# EAGLE design 38kHzSensorRevB1 (EAGLE 7.5.0)
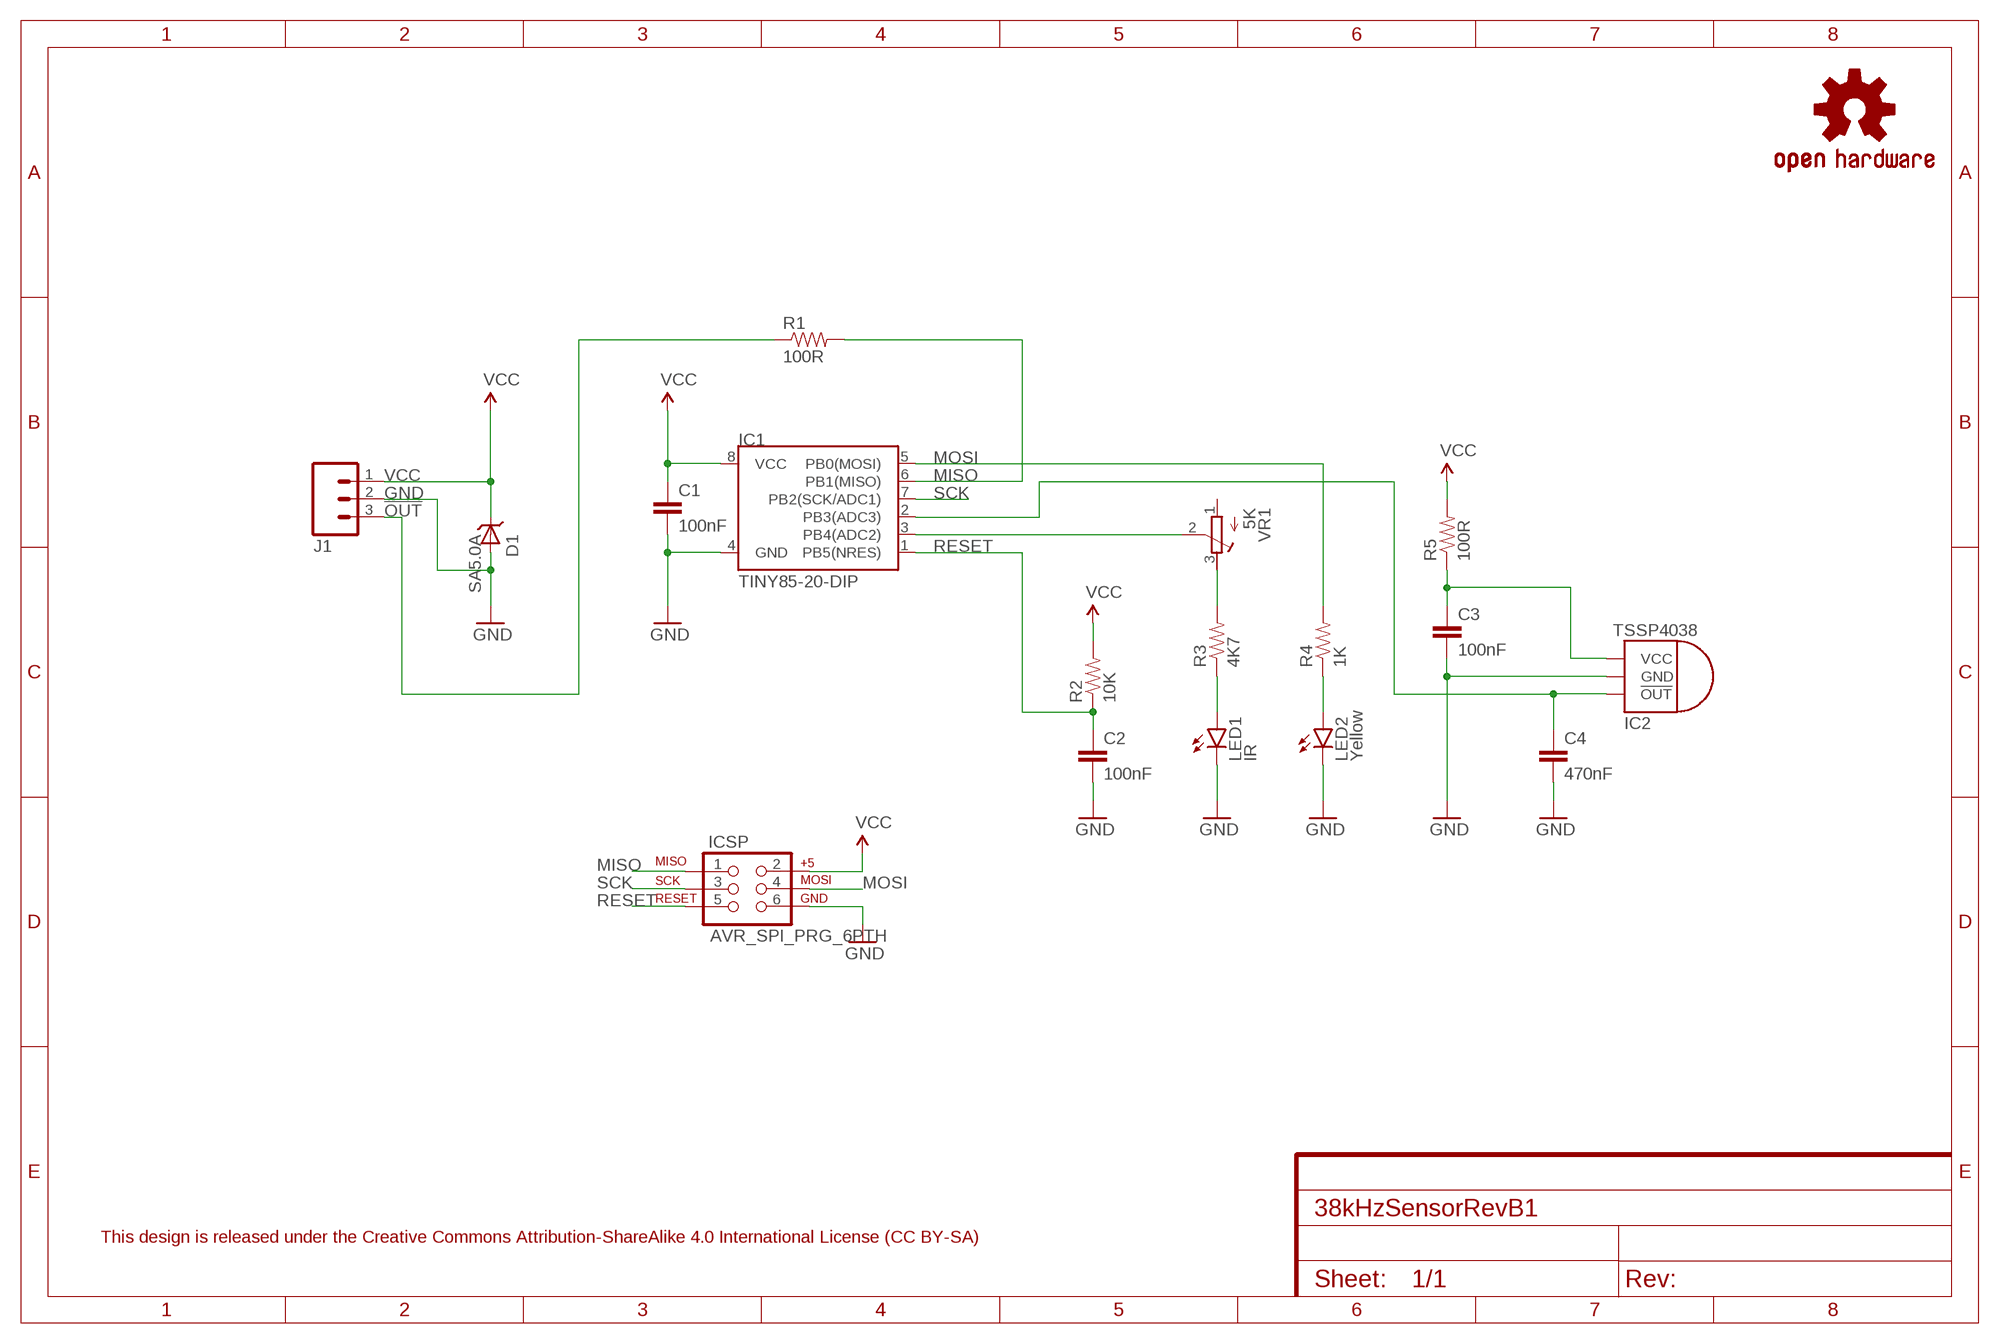
[diagram p0: schematic, sheet 1]
FRAME1 (FRAME-A4L): CNAME: 38kHz IR Simulator Sensor (Variant 1); CREVISION: B/1; DESIGNER: Andrew Instone-Cowie

## Parts
C1  100nF  CAPPTH  [CAP-PTH-SMALL]
C2  100nF  CAPPTH  [CAP-PTH-SMALL]
C3  100nF  CAPPTH  [CAP-PTH-SMALL]
C4  470nF  CAPPTH1  [CAP-PTH-5MM]
D1  SA5.0A  [DO41_TVS_UNI]
IC1  TINY85-20-DIP  ATTINY45TINY85-20-DIP  [DIP08]
IC2  TSSP4038EDGE  [TSSP4038_PKG_EDGE]
ICSP  AVR_SPI_PRG_6PTH  [2X3]
J1  M03PTH  [1X03]
LED1  IR  LED5MM  [LED5MM]
LED2  Yellow  LED3MM  [LED3MM]
LOGO1  OSHW-LOGOS  [OSHW-LOGO-S]
R1  100R  RESISTORPTH-1/4W  [AXIAL-0.4]
R2  10K  RESISTORPTH-1/4W  [AXIAL-0.4]
R3  4K7  RESISTORPTH-1/4W  [AXIAL-0.4]
R4  1K  RESISTORPTH-1/4W  [AXIAL-0.4]
R5  100R  RESISTORPTH-1/4W  [AXIAL-0.4]
VR1  5K  R-TRIMM3296X  [RTRIM3296X]

## Nets
!OUT: J1.3 R1.P$1
GND: C1.2 C2.2 C3.2 C4.2 D1.ANODE IC1.4(GND) IC2.GND ICSP.6 J1.2 LED1.K(C) LED2.K(C)
MISO: IC1.6(PB1(MISO)) ICSP.1 R1.P$2
MOSI: IC1.5(PB0(MOSI)) ICSP.4 R4.P$2
N$1: IC1.3(PB4(ADC2)) VR1.2(S)
N$2: R3.P$2 VR1.3(E)
N$3: C4.1 IC1.2(PB3(ADC3)) IC2.OUT(!OUT)
N$4: C3.1 IC2.VCC R5.P$1
N$5: LED1.A R3.P$1
N$6: LED2.A R4.P$1
RESET: C2.1 IC1.1(PB5(NRES)) ICSP.5 R2.P$1
SCK: IC1.7(PB2(SCK/ADC1)) ICSP.3
VCC: C1.1 D1.CATHODE IC1.8(VCC) ICSP.2 J1.1 R2.P$2 R5.P$2
Unconnected: VR1.1(A)

## Notes on the sheet
- This design is released under the Creative Commons Attribution-ShareAlike 4.0 International License (CC BY-SA)

## Library data of the parts
C1-C4 = SparkFun-Passives:CAP: Capacitor Standard 0603 ceramic capacitor, and 0.1" leaded capacitor.
D1 = AIC_Custom:SA5.0A: SA5.0CA TVS Uni-Directional Transient Voltage Suppressor. 5V, DO41 package
IC1 = SparkFun-DigitalIC:ATTINY45: Atmel 8-pin 2/4/8kB flash uC; PROD_ID: IC-09445
IC2 = AIC_Custom:TSSP4038: TSSP4038 38kHz IR Receiver
ICSP = SparkFun-Connectors:AVR_SPI_PRG_6: AVR ISP 6 Pin This is the reduced ISP connector for AVR programming. Common on Arduino. This footprint will take up less PCB space and can be used with a 10-pin to 6-pin adapter such as SKU: BOB-08508 **Special note about "TEST_POINT" package. The stop mask is on the top side, so if you want your programming test points to be on the bottom of your board, make sure to place this package on the bottom side of the board. This also ensure that the orientation to program from the bottom side will be correct.
J1 = SparkFun-Connectors:M03: Header 3 Standard 3-pin 0.1" header. Use with straight break away headers (SKU : PRT-00116), right angle break away headers (PRT-00553), swiss pins (PRT-00743), machine pins (PRT-00117), and female headers (PRT-00115). Molex polarized connector foot print use with SKU : PRT-08232 with associated crimp pins and housings.
LED1 LED2 = SparkFun-LED:LED: LEDs Standard schematic elements and footprints for 5mm, 3mm, 1206, and 0603 sized LEDs. 5mm - Spark Fun Electronics SKU : COM-00529 (and others)
LOGO1 = SparkFun-Aesthetics:OSHW-LOGO: Open Source Hardware Logo This logo indicates the piece of hardware it is found on incorporates a OSHW license and/or adheres to the definition of open source hardware found here: http://freedomdefined.org/OSHW
R1-R5 = SparkFun-Passives:RESISTOR: Resistor Basic schematic elements and footprints for 0603, 1206, and PTH resistors.
VR1 = resistor:R-TRIMM: Trimm resistor

## Board
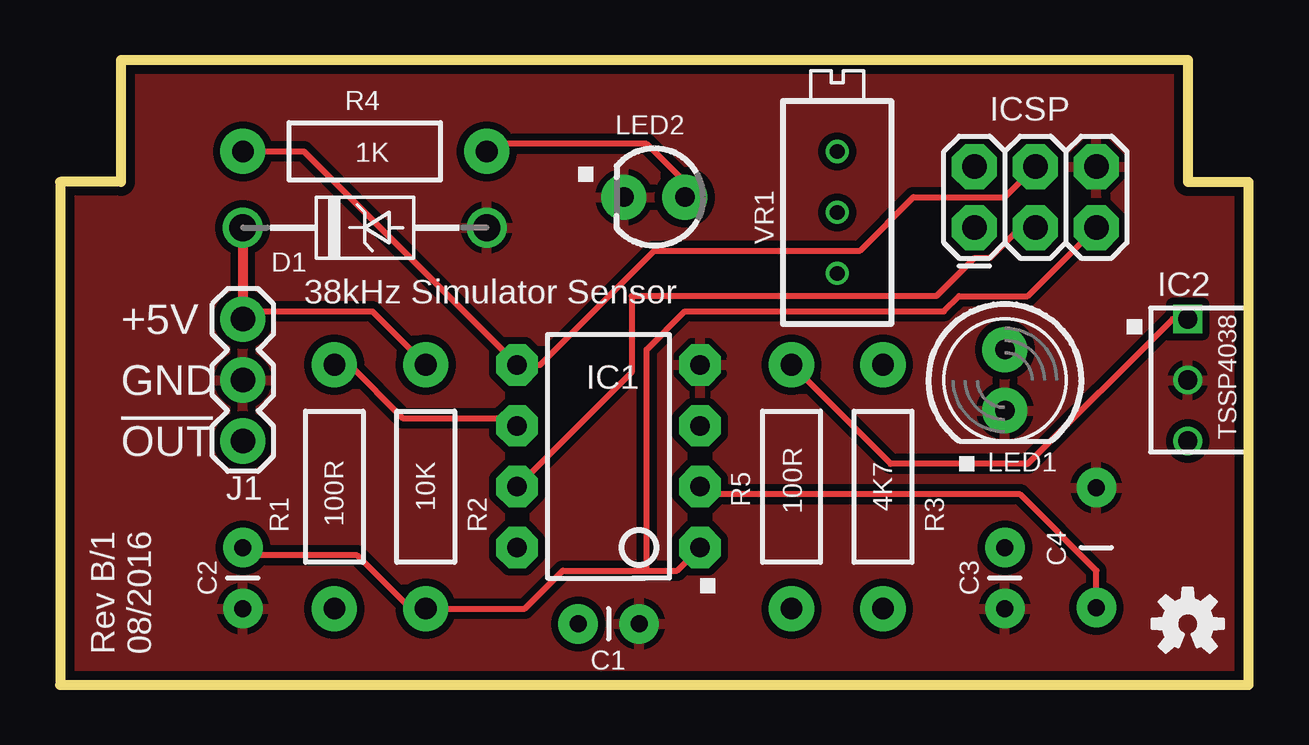
[diagram p1: board, top side]
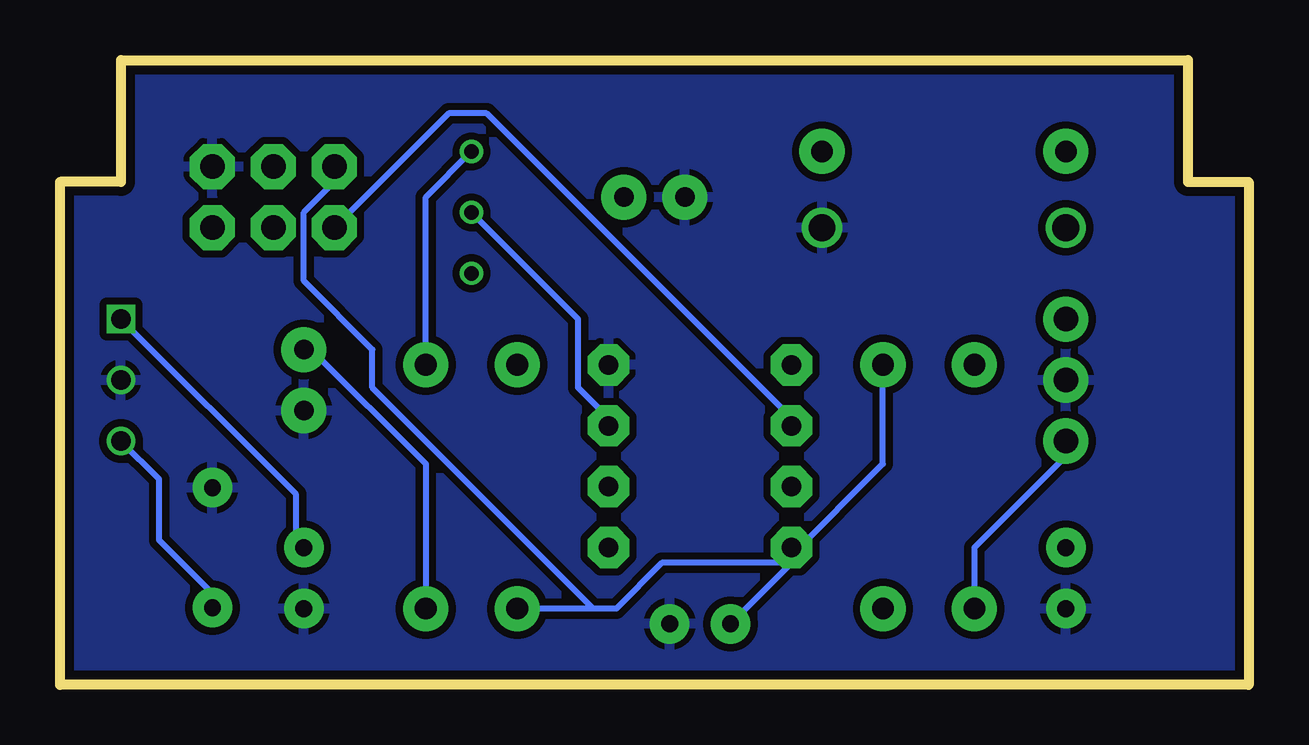
[diagram p2: board, bottom side, seen from below]

Size 49.53 x 26.04 mm. Coordinates in mm from the lower left corner, seen from the top.
Outline: 0,0 49.53,0 49.53,20.95 46.99,20.95 46.99,26.04 2.54,26.04 2.54,20.95 0,20.95 0,0
Copper layers (1*16): Top 0.0356mm / dielectric 1.5011mm / Bottom 0.0356mm
Design rules "LaenPCBOrder(OSHPARK)": minimum track width 6mil, minimum drill 13mil, track to track 6mil, track to pad 6mil, pad to pad 6mil, via to via 6mil, smd to smd 6mil, copper to edge 15mil, drill to drill 6mil, minimum pad ring 7mil, minimum via ring 7mil, stop-mask expansion 3mil, vias tented up to drill 0mil, thermal gap 10mil

### Footprints (pad centres in the part's own frame; a part is rotated, then mirrored left to right if it is on the bottom)
CAP-PTH-SMALL = drill 0.7 pad 1.651: 1 0,0; 2 2.54,0
CAP-PTH-5MM = drill 0.7 pad 1.651: 1 -2.5,0; 2 2.5,0
DO41_TVS_UNI = drill 1.118: ANODE -5.08,0; CATHODE 5.08,0
DIP08 = drill 0.813 pad 1.727 octagon: 1 -3.81,-3.81; 2 -1.27,-3.81; 3 1.27,-3.81; 4 3.81,-3.81; 5 3.81,3.81; 6 1.27,3.81; 7 -1.27,3.81; 8 -3.81,3.81
TSSP4038_PKG_EDGE = drill 0.8: GND 0,0; OUT 2.54,0 | drill 0.8 square: VCC -2.54,0
2X3 = drill 1.016 pad 1.88 octagon: 1 0,0; 2 0,2.54; 3 2.54,0; 4 2.54,2.54; 5 5.08,0; 6 5.08,2.54
1X03 = drill 1.016 pad 1.88: 1 0,0; 2 2.54,0; 3 5.08,0
LED5MM = drill 0.813 pad 1.88: A -1.27,0; K 1.27,0
LED3MM = drill 0.813 pad 1.88: A -1.27,0; K 1.27,0
AXIAL-0.4 = drill 0.9 pad 1.88: P$1 -5.08,0; P$2 5.08,0
RTRIM3296X = drill 0.61: 1 0,-2.54; 2 0,0; 3 0,2.54

### Placement (x,y rotation side)
C1  21.59,2.54 0 top
C2  7.62,5.71 270 top
C3  39.37,5.71 270 top
C4  43.18,5.71 90 top
D1  12.7,19.05 180 top
IC1  22.86,9.53 90 top
IC2  46.99,12.7 270 top
ICSP  38.1,19.05 0 top
J1  7.62,15.24 270 top
LED1  39.37,12.7 270 top
LED2  24.77,20.32 180 top
LOGO1  46.99,2.54 0 top
R1  11.43,8.26 90 top
R2  15.24,8.26 90 top
R3  34.29,8.26 90 top
R4  12.7,22.23 180 top
R5  30.48,8.26 270 top
VR1  32.38,19.68 0 top

### Tracks (layer width: path | path; a pad name or v marks a point on that pad's centre or on a via)
!OUT
  Bottom 0.254: R1.P$1 11.43,5.71 7.62,9.53 J1.3
GND
  pour Bottom (isolate 0.305): 2.54,26.04 2.54,20.95 0,20.95 0,0 49.53,0 49.53,20.95 46.99,20.95 46.99,26.04
  pour Top (isolate 0.305): 2.54,26.04 2.54,20.95 0,20.95 0,0 49.53,0 49.53,20.95 46.99,20.95 46.99,26.04
MISO
  Top 0.254: IC1.6 18.73,11.11 14.29,11.11 12.06,13.34 R1.P$2
  Bottom 0.254: ICSP.1 33.34,23.81 31.75,23.81 19.05,11.11 IC1.6
MOSI
  Top 0.254: R4.P$2 10.16,22.23 IC1.5 20,13.34 24.77,18.1 33.34,18.1 35.56,20.32 39.37,20.32 ICSP.4
N$1
  Bottom 0.254: VR1.2 27.94,15.24 27.94,12.38 26.67,11.11 IC1.3
N$2
  Bottom 0.254: VR1.3 34.29,20.32 R3.P$2
N$3
  Top 0.254: IC1.2 26.99,7.94 40.01,7.94 43.18,4.76 C4.1
  Bottom 0.254: IC2.OUT 45.4,8.57 45.4,6.03 43.18,3.81 C4.1
N$4
  Top 0.254: R5.P$1 34.61,9.21 40.32,9.21 46.35,15.24 IC2.VCC
  Bottom 0.254: IC2.VCC 39.69,7.94 39.69,6.03 C3.1
N$5
  Bottom 0.254: R3.P$1 34.29,9.21 39.05,13.97 LED1.A
N$6
  Top 0.254: R4.P$1 18.1,22.54 24.45,22.54 26.04,20.95 LED2.A
RESET
  Top 0.254: C2.1 7.94,5.4 12.38,5.4 14.61,3.17 R2.P$1 19.37,3.17 20.95,4.76 24.45,4.76 | IC1.1 25.72,4.76 24.45,4.76 | ICSP.5 40.32,16.19 37.47,16.19 36.83,15.56 26.04,15.56 24.45,13.97 24.45,4.76
SCK
  Top 0.254: IC1.7 23.81,13.02 23.81,16.19 36.51,16.19 38.1,17.78 38.73,17.78 40.01,19.05 ICSP.3
VCC
  Top 0.254: R2.P$2 13.02,15.56 7.62,15.56
  Top 0.406: 7.62,15.56 J1.1 D1.CATHODE
  Bottom 0.254: 19.05,5.08 C1.1 | 27.3,3.17 26.35,3.17 24.45,5.08 19.05,5.08 | 27.3,3.17 R5.P$2 | 19.05,5.08 19.05,5.4 | ICSP.2 38.1,20.95 39.37,19.68 39.37,16.83 36.51,13.97 36.51,12.38 27.3,3.17 | R2.P$2 15.24,9.21 19.05,5.4 | 19.05,5.4 IC1.8

### Text on the board
tPlace: 38kHz Simulator Sensor | +5V / GND / !OUT | Rev B/1 / 08/2016